# EasyEDA schematic EasyEdaSchematic.json
TITLE: technoLARP board; REV: 1.1; Date: 2023-03-23; Sheet: 1/1; Drawn By: technoLARP; Company: technoLarp
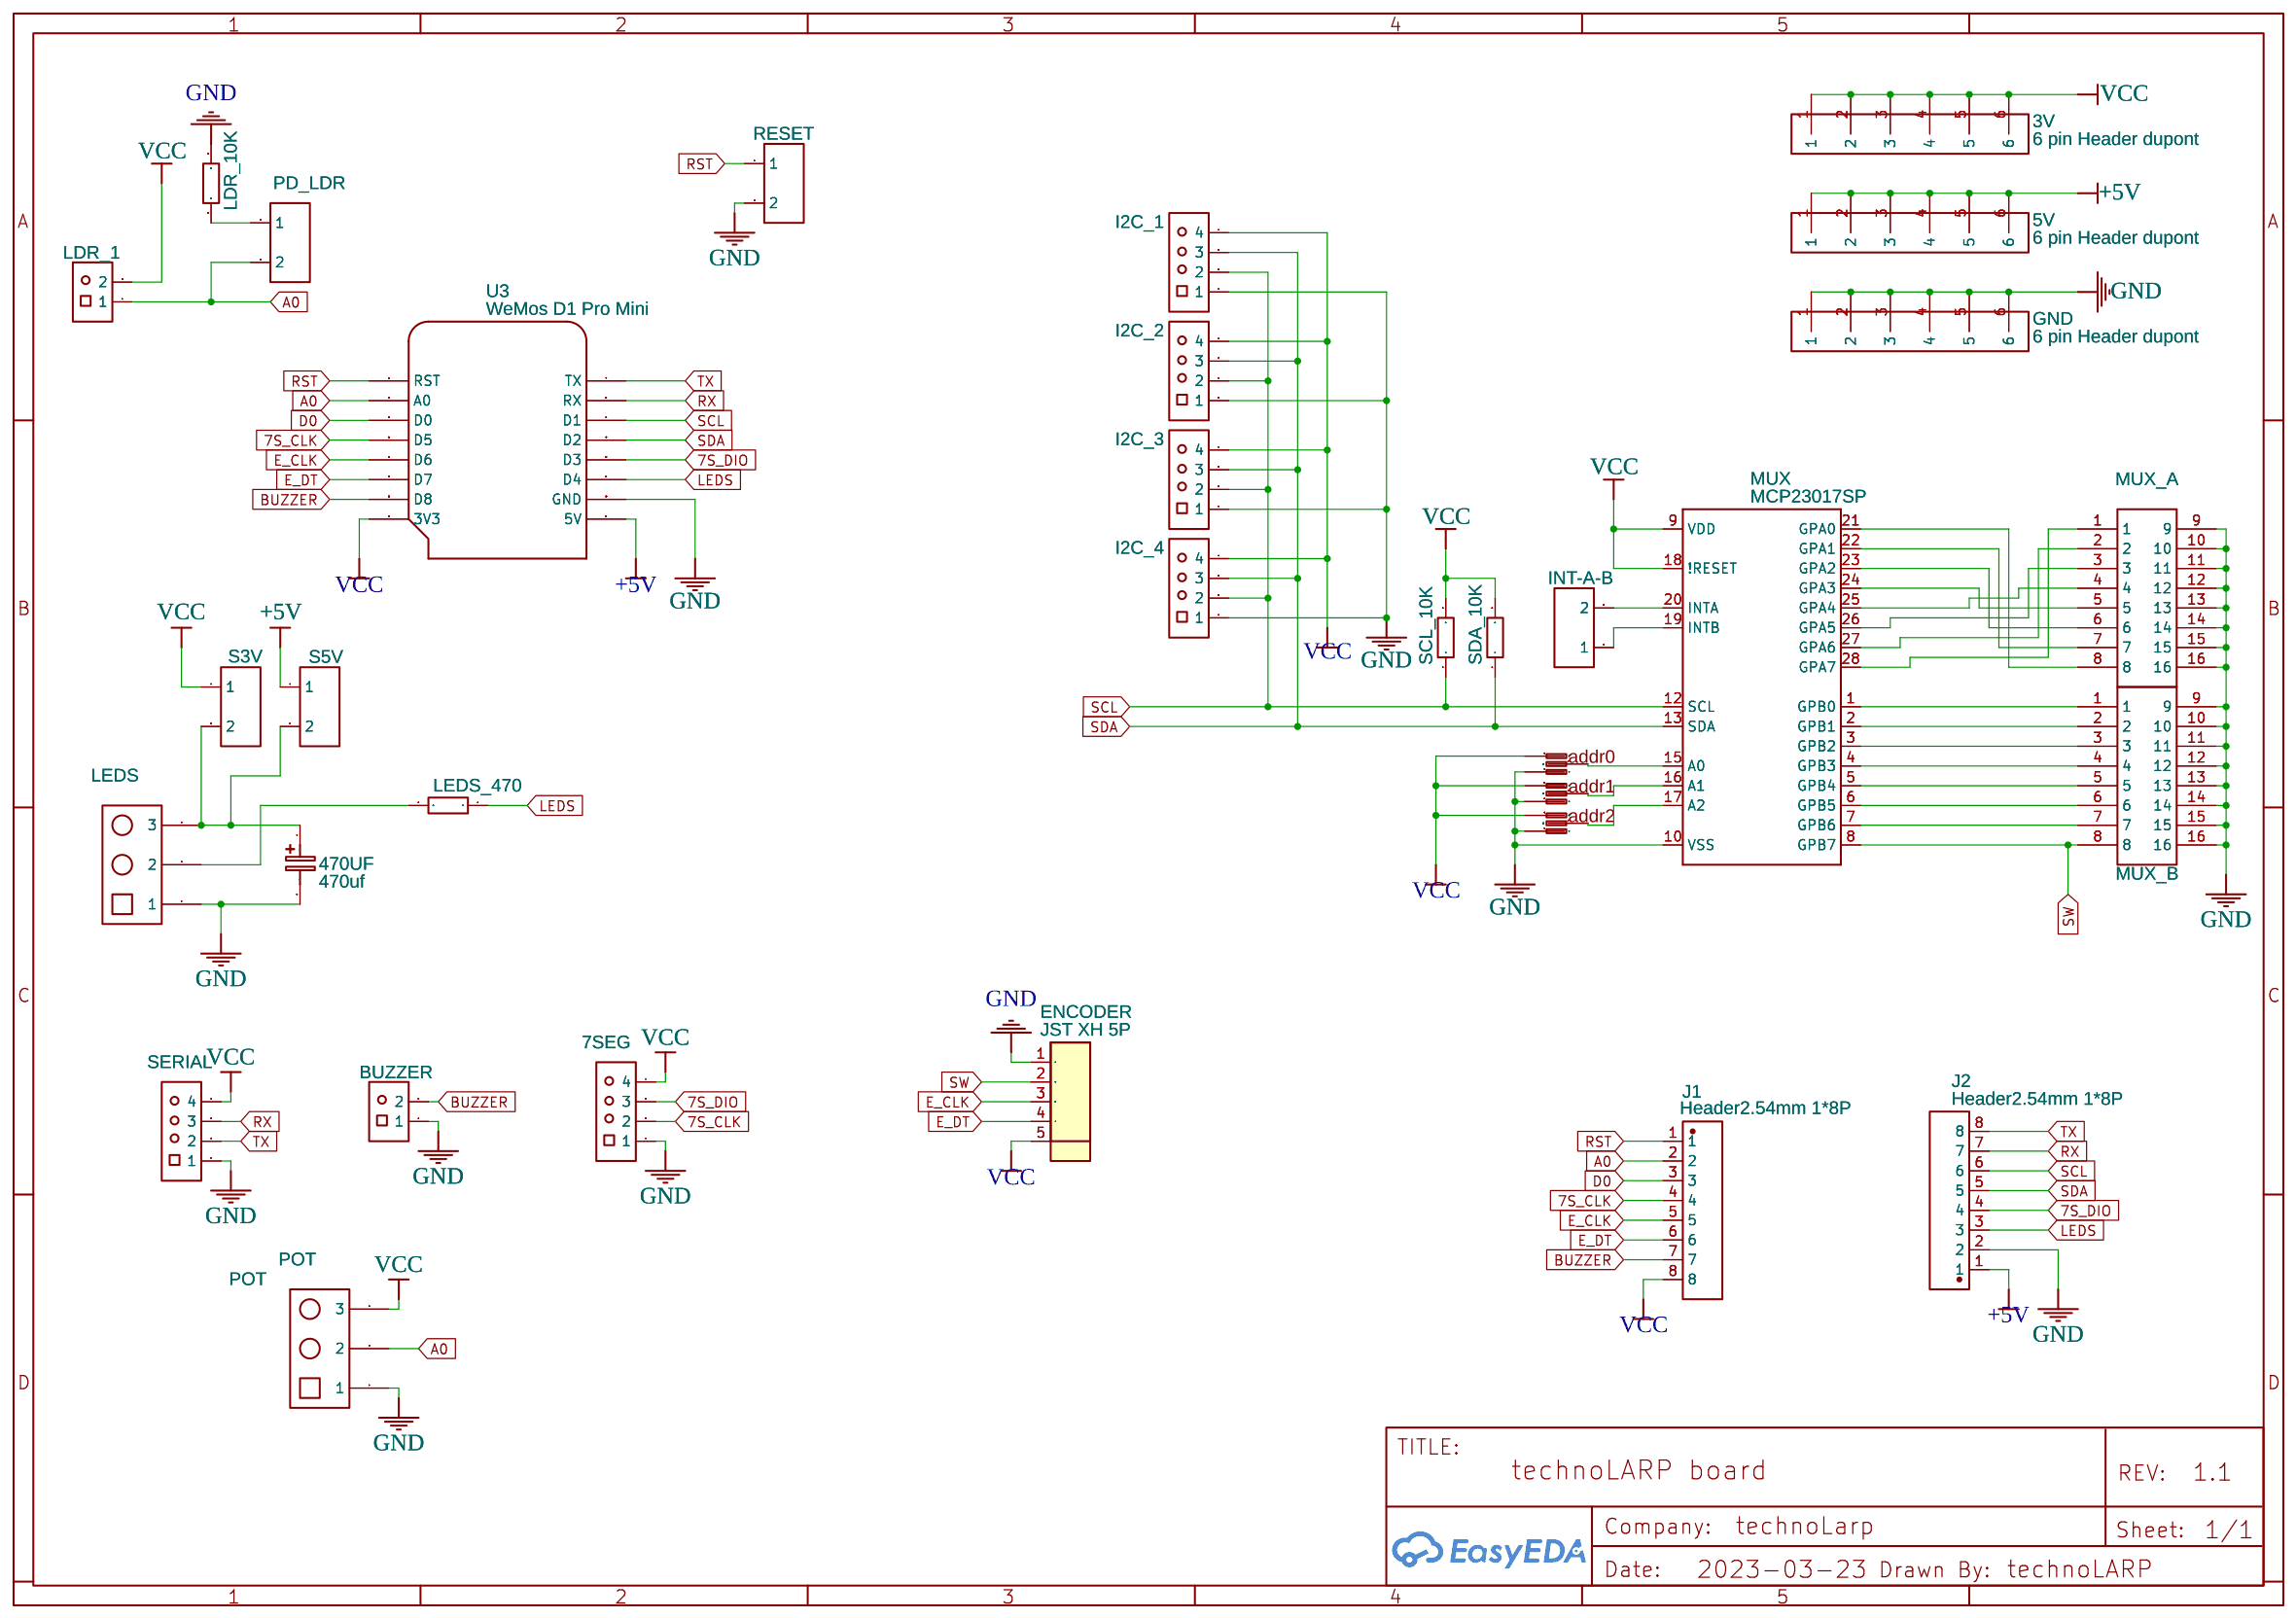
[diagram p0: schematic sheet]

## Parts
3V  6 pin Header dupont  [6 PIN HEADER DUPONT]
5V  6 pin Header dupont  [6 PIN HEADER DUPONT]
7SEG  7SEG  [JST_4-PIN_2.54MM]
470UF  470uf  [CAP-D5.0XF2.0]
ADDR0  3 PAD SOLDER JUMPER  [3PAD_SOLDER_JUMPER]
ADDR1  3 PAD SOLDER JUMPER  [3PAD_SOLDER_JUMPER]
ADDR2  3 PAD SOLDER JUMPER  [3PAD_SOLDER_JUMPER]
BUZZER  BUZZER  [JST_2-PIN_2.54MM]
ENCODER  JST XH 5P  [CN_HDR_1X5_180D_P25_JST_B5B-XH]
GND  6 pin Header dupont  [6 PIN HEADER DUPONT]
I2C_1  I2C_1  [JST_4-PIN_2.54MM]
I2C_2  I2C_2  [JST_4-PIN_2.54MM]
I2C_3  I2C_3  [JST_4-PIN_2.54MM]
I2C_4  I2C_4  [JST_4-PIN_2.54MM]
INT-A-B  Header-Male-2.54_1x2  [HDR-TH_2P-P2.54-V]
J1  Header2.54mm 1*8P  [HDR-TH_8P-P2.54-V]
J2  Header2.54mm 1*8P  [HDR-TH_8P-P2.54-V]
LDR  LDR_1  [JST_2-PIN_2.54MM]
LDR_10K  10k  [AXIAL-0.3]
LEDS  JST-XH-03P  [JST-XH-03P]
LEDS_470  10k  [AXIAL-0.3]
MUX  MCP23017SP  [DIP28-300]
MUX_A  2x8pin  [2X8PIN]
MUX_B  2x8pin  [2X8PIN]
PD_LDR  Header-Male-2.54_1x2  [HDR-TH_2P-P2.54-V]
POT  POT  [JST-XH-03P]
RESET  RESET  [HDR-TH_2P-P2.54-V]
RXTX  SERIAL  [JST_4-PIN_2.54MM]
S3V  RESET  [HDR-TH_2P-P2.54-V]
S5V  RESET  [HDR-TH_2P-P2.54-V]
SCL_10K  10k  [AXIAL-0.3]
SDA_10K  10k  [AXIAL-0.3]
U3  WeMos D1 Pro Mini  [WEMOS D1 MINI PRO]

## Library data of the parts
3V 5V GND = 6 pin Header dupont: Contributor: AmauryMaker
7SEG BUZZER I2C_1-I2C_4 LDR RXTX = -: Manufacturer Part: JST_XH CONNECTOR; link: https://nl.aliexpress.com/item/50-sets-Kit-in-doos-2-p-3-p-4-pin-2-54mm-Pitch-Terminal-Behuizing/32681086028.html?spm=a2g0s.9042311.0.0.I0g15Z; Contributor: CowboyWillT
470UF = Cap_Electrolytic(TH)_D5.0XF2.0_EU: Contributor: EasyEDA
ADDR0-ADDR2 = 3 PAD SOLDER JUMPER: Contributor: BarisAlp
ENCODER = JST XH 5P: Supplier Part: C61277; Supplier: LCSC; Digi-Key: 455-2249-ND
INT-A-B PD_LDR RESET S3V S5V = Header-Male-2.54_1x2: Supplier: LCSC; Manufacturer: TE Connectivity; Manufacturer Part: 826629-2; Supplier Part: C86471; JLCPCB Part Class: Extended Part
J1 J2 = Header2.54mm 1*8P: Supplier Part: C49256; Supplier: LCSC; Manufacturer: ReliaPro
LDR_10K LEDS_470 SCL_10K SDA_10K = Res_AXIAL-0.3(1/8W)_EU: Manufacturer Part: ?
LEDS POT = JST-XH-03P: Contributor: j.arts87
MUX = -: http:ww1.microchip.comdownloadsenDeviceDoc21952a.pdf; Contributor: Adafruit; Manufacturer Part: ?
MUX_A MUX_B = 2x8pin: Contributor: karlab
U3 = WeMos D1 Pro Mini: Manufacturer Part: WeMos D1 Mini Pro; Supplier Part: undefined; Contributor: Alexus-12

## Nets
+5V: 5V.1 5V.2 5V.3 5V.4 5V.5 5V.6 J2.1 S5V.1 U3.5V
GND: 7SEG.1 470UF.2 ADDR0.1 ADDR1.1 ADDR2.1 BUZZER.1 ENCODER.1 GND.1 GND.2 GND.3 GND.4 GND.5 GND.6 I2C_1.1 I2C_2.1 I2C_3.1 I2C_4.1 J2.2 LDR_10K.2 LEDS.1 MUX.10(VSS) MUX_A.9 MUX_A.10 MUX_A.11 MUX_A.12 MUX_A.13 MUX_A.14 MUX_A.15 MUX_A.16 MUX_B.9 MUX_B.10 MUX_B.11 MUX_B.12 MUX_B.13 MUX_B.14 MUX_B.15 MUX_B.16 POT.1 RESET.2 RXTX.1 U3.GND
VCC: 3V.1 3V.2 3V.3 3V.4 3V.5 3V.6 7SEG.4 ADDR0.3(0) ADDR1.3(0) ADDR2.3(0) ENCODER.5 I2C_1.4 I2C_2.4 I2C_3.4 I2C_4.4 J1.8 LDR.2 MUX.9(VDD) MUX.18(!RESET) POT.3 RXTX.4 S3V.1 SCL_10K.2 SDA_10K.2 U3.3V3
7S_CLK: 7SEG.2 J1.4 U3.D5
7S_DIO: 7SEG.3 J2.4 U3.D3
A0: J1.2 LDR.1 PD_LDR.2 POT.2 U3.A0
BUZZER: BUZZER.2 J1.7 U3.D8
D0: J1.3 U3.D0
E_CLK: ENCODER.3 J1.5 U3.D6
E_DT: ENCODER.4 J1.6 U3.D7
LEDS: J2.3 LEDS_470.1 U3.D4
RST: J1.1 RESET.1 U3.RST
RX: J2.7 RXTX.3 U3.RX
SCL: I2C_1.2 I2C_2.2 I2C_3.2 I2C_4.2 J2.6 MUX.12(SCL) SCL_10K.1 U3.D1
SDA: I2C_1.3 I2C_2.3 I2C_3.3 I2C_4.3 J2.5 MUX.13(SDA) SDA_10K.1 U3.D2
SW: ENCODER.2 MUX.8(GPB7) MUX_B.8
TX: J2.8 RXTX.2 U3.TX
Net-(470UF-1): 470UF.1 LEDS.3 S3V.2 S5V.2
Net-(ADDR0-2): ADDR0.2(BOOT) MUX.15(A0)
Net-(ADDR1-2): ADDR1.2(BOOT) MUX.16(A1)
Net-(ADDR2-2): ADDR2.2(BOOT) MUX.17(A2)
Net-(INT-A-B-1): INT-A-B.1 MUX.19(INTB)
Net-(INT-A-B-2): INT-A-B.2 MUX.20(INTA)
Net-(LDR_10K-1): LDR_10K.1 PD_LDR.1
Net-(LEDS-2): LEDS.2 LEDS_470.2
Net-(MUX-1): MUX.1(GPB0) MUX_B.1
Net-(MUX-2): MUX.2(GPB1) MUX_B.2
Net-(MUX-3): MUX.3(GPB2) MUX_B.3
Net-(MUX-4): MUX.4(GPB3) MUX_B.4
Net-(MUX-5): MUX.5(GPB4) MUX_B.5
Net-(MUX-6): MUX.6(GPB5) MUX_B.6
Net-(MUX-7): MUX.7(GPB6) MUX_B.7
Net-(MUX-21): MUX.21(GPA0) MUX_A.8
Net-(MUX-22): MUX.22(GPA1) MUX_A.7
Net-(MUX-23): MUX.23(GPA2) MUX_A.6
Net-(MUX-24): MUX.24(GPA3) MUX_A.5
Net-(MUX-25): MUX.25(GPA4) MUX_A.4
Net-(MUX-26): MUX.26(GPA5) MUX_A.3
Net-(MUX-27): MUX.27(GPA6) MUX_A.2
Net-(MUX-28): MUX.28(GPA7) MUX_A.1
